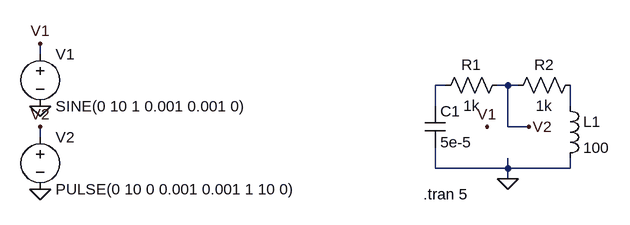
[diagram p0: schematic Draft1.asc]
Draft1.asc, the LTspice schematic file:
Version 4
SHEET 1 880 680
WIRE -560 16 -560 0
WIRE 64 64 48 64
WIRE 160 64 144 64
WIRE 176 64 160 64
WIRE 48 96 48 64
WIRE 256 96 256 64
WIRE 160 128 160 64
WIRE 192 128 160 128
WIRE -560 144 -560 128
WIRE 48 192 48 160
WIRE 160 192 160 176
WIRE 160 192 48 192
WIRE 256 192 256 176
WIRE 256 192 160 192
WIRE 160 208 160 192
FLAG 160 208 0
FLAG 128 128 V1
FLAG 192 128 V2
FLAG -560 224 0
FLAG -560 96 0
FLAG -560 0 V1
FLAG -560 128 V2
SYMBOL cap 32 96 R0
SYMATTR InstName C1
SYMATTR Value 5e-5
SYMBOL ind 240 80 R0
SYMATTR InstName L1
SYMATTR Value 100
SYMBOL voltage -560 0 R0
WINDOW 123 0 0 Left 0
WINDOW 39 0 0 Left 0
SYMATTR InstName V1
SYMATTR Value SINE(0 10 1 0.001 0.001 0)
SYMBOL res 160 48 R90
WINDOW 0 0 56 VBottom 2
WINDOW 3 32 56 VTop 2
SYMATTR InstName R1
SYMATTR Value 1k
SYMBOL res 272 48 R90
WINDOW 0 0 56 VBottom 2
WINDOW 3 32 56 VTop 2
SYMATTR InstName R2
SYMATTR Value 1k
SYMBOL voltage -560 128 R0
WINDOW 123 0 0 Left 0
WINDOW 39 0 0 Left 0
SYMATTR InstName V2
SYMATTR Value PULSE(0 10 0 0.001 0.001 1 10 0)
TEXT 30 232 Left 2 !.tran 5

The netlist it stands for:
* Draft1.asc
C1 N001 0 5e-5
L1 N002 0 100
V1 V1 0 SINE(0 10 1 0.001 0.001 0)
R1 V2 N001 1k
R2 N002 V2 1k
V2 V2 0 PULSE(0 10 0 0.001 0.001 1 10 0)
.tran 5
.backanno
.end

* Results of the author's LTspice run, read from the files saved beside the schematic
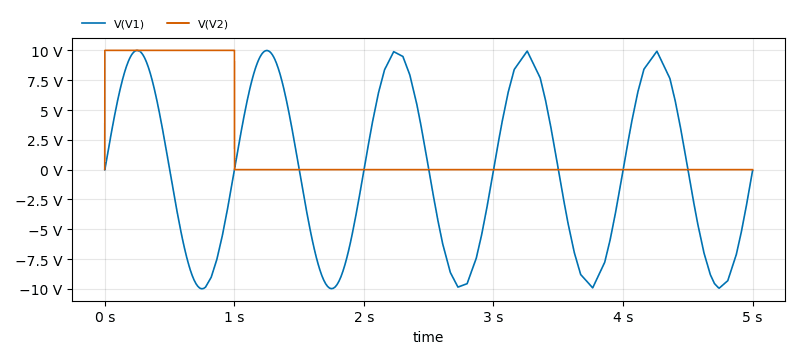
[diagram p1: Transient Analysis of Draft1.asc, plotted from the saved traces]
* Transient Analysis, 1 run:
*   V(V1): min -9.991 V, max 9.997 V, average -6.874 mV, rms 7.002 V, last -62.52 mV
*   V(V2): min 0 V, max 10 V, average 2.002 V, rms 4.474 V, last 0 V